# EAGLE design alphanewt_v1.8 (EAGLE 8.4.1)
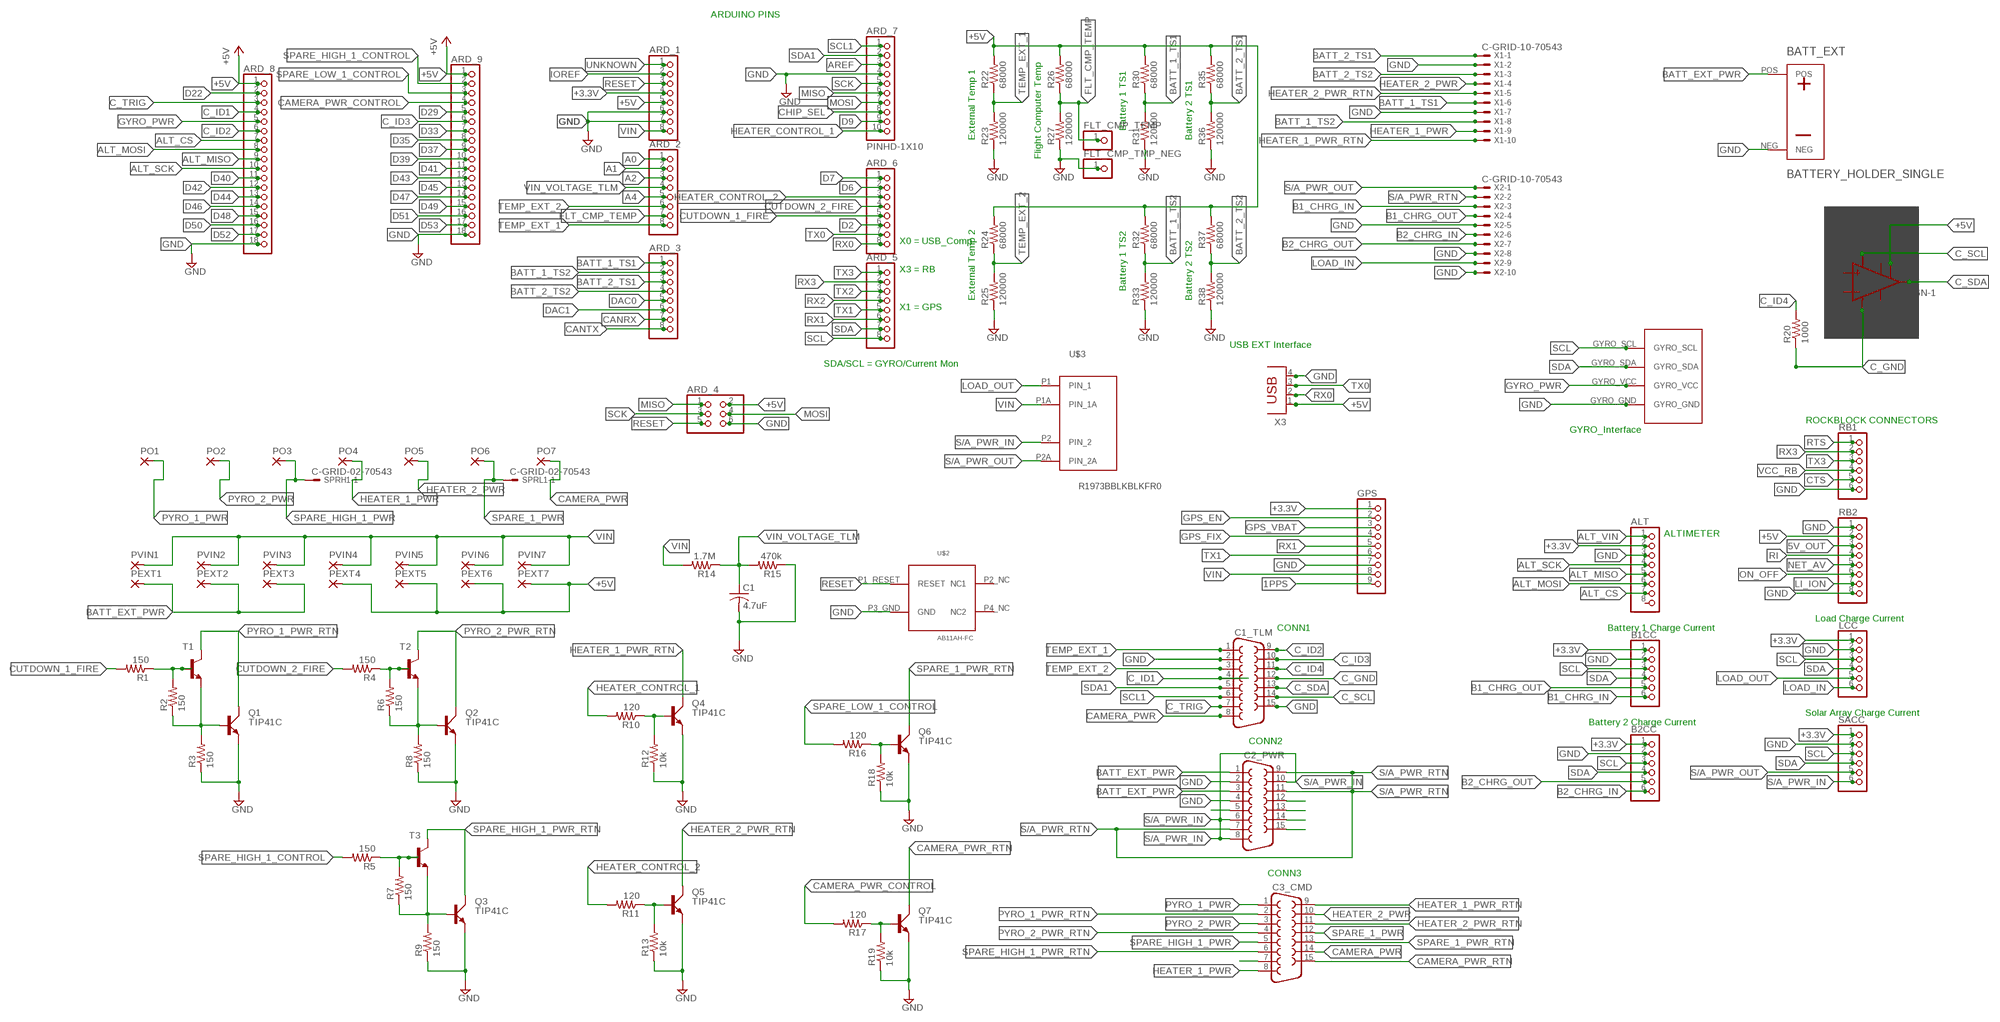
[diagram p0: schematic, sheet 1]

## Parts
ALT  PINHD-1X8BIG  [1X08-BIG]
ARD_1  PINHD-1X8BIG  [1X08-BIG]
ARD_2  PINHD-1X8BIG  [1X08-BIG]
ARD_3  PINHD-1X8BIG  [1X08-BIG]
ARD_4  PINHD-2X3  [2X03]
ARD_5  PINHD-1X8BIG  [1X08-BIG]
ARD_6  PINHD-1X8BIG  [1X08-BIG]
ARD_7  PINHD-1X10  [1X10-BIG]
ARD_8  PINHD-1X18-BIG  [1X18-BIG]
ARD_9  PINHD-1X18-BIG  [1X18-BIG]
B1CC  PINHD-1X6B  [1X06-BIG]
B2CC  PINHD-1X6B  [1X06-BIG]
BATT_EXT  BATTERY_HOLDER_SINGLE  [BATT_HOLDER_SINGLE]
C1  4.7uF  C-USC0805K  [C0805K]
C1_TLM  F15HP  [F15HP]
C2_PWR  F15HP  [F15HP]
C3_CMD  F15HP  [F15HP]
FLT_CMP_TEMP  PINHD-1X1  [1X01]
FLT_CMP_TMP_NEG  PINHD-1X1  [1X01]
GPS  PINHD-1X9  [1X09-BIG]
IC1  LM386N-1  [DIL08]
LCC  PINHD-1X6B  [1X06-BIG]
PEXT1  SMD2  [SMD1,27-2,54]
PEXT2  SMD2  [SMD1,27-2,54]
PEXT3  SMD2  [SMD1,27-2,54]
PEXT4  SMD2  [SMD1,27-2,54]
PEXT5  SMD2  [SMD1,27-2,54]
PEXT6  SMD2  [SMD1,27-2,54]
PEXT7  SMD2  [SMD1,27-2,54]
PO1  SMD2  [SMD1,27-2,54]
PO2  SMD2  [SMD1,27-2,54]
PO3  SMD2  [SMD1,27-2,54]
PO4  SMD2  [SMD1,27-2,54]
PO5  SMD2  [SMD1,27-2,54]
PO6  SMD2  [SMD1,27-2,54]
PO7  SMD2  [SMD1,27-2,54]
PVIN1  SMD2  [SMD1,27-2,54]
PVIN2  SMD2  [SMD1,27-2,54]
PVIN3  SMD2  [SMD1,27-2,54]
PVIN4  SMD2  [SMD1,27-2,54]
PVIN5  SMD2  [SMD1,27-2,54]
PVIN6  SMD2  [SMD1,27-2,54]
PVIN7  SMD2  [SMD1,27-2,54]
Q1  TIP41C  [TO220AV]
Q2  TIP41C  [TO220AV]
Q3  TIP41C  [TO220AV]
Q4  TIP41C  [TO220AV]
Q5  TIP41C  [TO220AV]
Q6  TIP41C  [TO220AV]
Q7  TIP41C  [TO220AV]
R1  150  R-US_R0805  [R0805]
R2  150  R-US_R0805  [R0805]
R3  150  R-US_R0805  [R0805]
R4  150  R-US_R0805  [R0805]
R5  150  R-US_R0805  [R0805]
R6  150  R-US_R0805  [R0805]
R7  150  R-US_R0805  [R0805]
R8  150  R-US_R0805  [R0805]
R9  150  R-US_R0805  [R0805]
R10  120  R-US_R0805  [R0805]
R11  120  R-US_R0805  [R0805]
R12  10k  R-US_R0805  [R0805]
R13  10k  R-US_R0805  [R0805]
R14  1.7M  R-US_R0805  [R0805]
R15  470k  R-US_R0805  [R0805]
R16  120  R-US_R0805  [R0805]
R17  120  R-US_R0805  [R0805]
R18  10k  R-US_R0805  [R0805]
R19  10k  R-US_R0805  [R0805]
R20  1000  R-US_R0805  [R0805]
R22  68000  R-US_R0805  [R0805]
R23  120000  R-US_R0805  [R0805]
R24  68000  R-US_R0805  [R0805]
R25  120000  R-US_R0805  [R0805]
R26  68000  R-US_R0805  [R0805]
R27  120000  R-US_R0805  [R0805]
R30  68000  R-US_R0805  [R0805]
R31  120000  R-US_R0805  [R0805]
R32  68000  R-US_R0805  [R0805]
R33  120000  R-US_R0805  [R0805]
R35  68000  R-US_R0805  [R0805]
R36  120000  R-US_R0805  [R0805]
R37  68000  R-US_R0805  [R0805]
R38  120000  R-US_R0805  [R0805]
RB1  PINHD-1X6CB  [1X06-CLEANBIG]
RB2  PINHD-1X8BIG  [1X08-BIG]
SACC  PINHD-1X6B  [1X06-BIG]
SPRH1  C-GRID-02-70543  [70543-02]
SPRL1  C-GRID-02-70543  [70543-02]
T1  2N3904  [TO92]
T2  2N3904  [TO92]
T3  2N3904  [TO92]
U$2  AB11AH-FC  [AB11AH-FC]
U$3  R1973BBLKBLKFR0  [R1973BBLKBLKFR0]
U$4  GYRO_MPU9250_FOOTPRINT  [MPU9250_FOOTPRINT]
X1  C-GRID-10-70543  [70543-10]
X2  C-GRID-10-70543  [70543-10]
X3  PN87520  [PN87520]

## Nets
1PPS: GPS.9
5V_OUT: RB2.3
+3.3V [PWR]: ALT.2 ARD_1.4 B1CC.1 B2CC.1 GPS.1 LCC.1 SACC.1
+5V [PWR]: ARD_1.5 ARD_4.2 ARD_8.1 ARD_9.1 IC1.8(GAIN) PEXT4.1(P) PEXT5.1(P) PEXT6.1(P) PEXT7.1(P) R22.2 R24.2 R26.2 R30.2 R32.2 R35.2 R37.2 RB2.2 X3.1
A0: ARD_2.1
A1: ARD_2.2
A2: ARD_2.3
A4: ARD_2.5
ALT_CS: ALT.7 ARD_8.7
ALT_MISO: ALT.5 ARD_8.9
ALT_MOSI: ALT.6 ARD_8.8
ALT_SCK: ALT.4 ARD_8.10
ALT_VIN: ALT.1
AREF: ARD_7.3
B1_CHRG_IN [PWR]: B1CC.6 X2.3
B1_CHRG_OUT [PWR]: B1CC.5 X2.4
B2_CHRG_IN [PWR]: B2CC.6 X2.6
B2_CHRG_OUT [PWR]: B2CC.5 X2.7
BATT_1_TS1: ARD_3.1 R30.1 R31.2 X1.6
BATT_1_TS2: ARD_3.2 R32.1 R33.2 X1.8
BATT_2_TS1: ARD_3.3 R35.1 R36.2 X1.1
BATT_2_TS2: ARD_3.4 R37.1 R38.2 X1.3
BATT_EXT_PWR [PWR]: BATT_EXT.POS C2_PWR.1 C2_PWR.3 PEXT1.1(P) PEXT2.1(P) PEXT3.1(P)
C_GND: C1_TLM.12 IC1.4(GND) R20.1
C_ID1: ARD_8.4 C1_TLM.4
C_ID2: ARD_8.6 C1_TLM.9
C_ID3: ARD_9.6 C1_TLM.10
C_ID4: C1_TLM.11 R20.2
C_SCL: C1_TLM.14 IC1.6(VS)
C_SDA: C1_TLM.13 IC1.5(OUT)
C_TRIG: ARD_8.3 C1_TLM.7
CAMERA_PWR [PWR]: C1_TLM.8 C3_CMD.14 PO7.1(P)
CAMERA_PWR_CONTROL: ARD_9.4 R17.2
CAMERA_PWR_RTN [PWR]: C3_CMD.15 Q7.C
CANRX: ARD_3.7
CANTX: ARD_3.8
CHIP_SEL: ARD_7.8
CTS: RB1.5
CUTDOWN_1_FIRE: ARD_6.5 R1.2
CUTDOWN_2_FIRE: ARD_6.4 R4.2
D2: ARD_6.6
D6: ARD_6.2
D7: ARD_6.1
D9: ARD_7.9
D22: ARD_8.2
D29: ARD_9.5
D33: ARD_9.7
D35: ARD_9.8
D37: ARD_9.9
D39: ARD_9.10
D40: ARD_8.11
D41: ARD_9.11
D42: ARD_8.12
D43: ARD_9.12
D44: ARD_8.13
D45: ARD_9.13
D46: ARD_8.14
D47: ARD_9.14
D48: ARD_8.15
D49: ARD_9.15
D50: ARD_8.16
D51: ARD_9.16
D52: ARD_8.17
D53: ARD_9.17
DAC0: ARD_3.5
DAC1: ARD_3.6
FLT_CMP_TEMP: ARD_2.7 FLT_CMP_TEMP.1 R26.1 R27.2
GND [PWR]: ALT.3 ARD_1.6 ARD_1.7 ARD_4.6 ARD_7.4 ARD_8.18 ARD_9.18 B1CC.2 B2CC.2 BATT_EXT.NEG C1.2 C1_TLM.2 C1_TLM.15 C2_PWR.2 C2_PWR.4 FLT_CMP_TMP_NEG.1 GPS.7 LCC.2 Q1.E Q2.E Q3.E Q4.E Q5.E Q6.E Q7.E R3.1 R8.1 R9.1 R12.1 R13.1 R15.1 R18.1 R19.1 R23.1 R25.1 R27.1 R31.1 R33.1 R36.1 R38.1 RB1.6 RB2.1 RB2.8 SACC.2 U$2.P3_GND(GND) U$4.GYRO_GND X1.2 X1.7 X2.5 X2.8 X2.10 X3.4
GPS_EN: GPS.2
GPS_FIX: GPS.4
GPS_VBAT: GPS.3
GYRO_PWR: ARD_8.5 U$4.GYRO_VCC
HEATER_1_PWR [PWR]: C3_CMD.8 PO4.1(P) X1.9
HEATER_1_PWR_RTN [PWR]: C3_CMD.9 Q4.C X1.10
HEATER_2_PWR [PWR]: C3_CMD.10 PO5.1(P) X1.4
HEATER_2_PWR_RTN [PWR]: C3_CMD.11 Q5.C X1.5
HEATER_CONTROL_1: ARD_7.10 R10.2
HEATER_CONTROL_2: ARD_6.3 R11.2
IOREF: ARD_1.2
LI_ION: RB2.7
LOAD_IN [PWR]: LCC.6 X2.9
LOAD_OUT [PWR]: LCC.5 U$3.P1(PIN_1)
MISO: ARD_4.1 ARD_7.6
MOSI: ARD_4.4 ARD_7.7
N$15: R4.1 R6.2 T2.2(B)
N$16: R1.1 R2.2 T1.2(B)
N$18: Q4.B R10.1 R12.2
N$19: Q2.B R6.1 R8.2 T2.3(E)
N$22: Q5.B R11.1 R13.2
N$23: Q1.B R2.1 R3.2 T1.3(E)
N$24: Q6.B R16.1 R18.2
N$26: R5.1 R7.2 T3.2(B)
N$27: Q3.B R7.1 R9.2 T3.3(E)
N$31: Q7.B R17.1 R19.2
N$47: C2_PWR.12
N$48: C2_PWR.13
N$49: C2_PWR.14
N$50: C2_PWR.15
N$55: C2_PWR.5
N$72 [PWR]: C3_CMD.7
NET_AV: RB2.5
ON_OFF: RB2.6
PYRO_1_PWR [PWR]: C3_CMD.1 PO1.1(P)
PYRO_1_PWR_RTN [PWR]: C3_CMD.2 Q1.C T1.1(C)
PYRO_2_PWR [PWR]: C3_CMD.3 PO2.1(P)
PYRO_2_PWR_RTN [PWR]: C3_CMD.4 Q2.C T2.1(C)
RESET: ARD_1.3 ARD_4.5 U$2.P1_RESET(RESET)
RI: RB2.4
RTS: RB1.1
RX0: ARD_6.8 X3.2
RX1: ARD_5.6 GPS.5
RX2: ARD_5.4
RX3: ARD_5.2 RB1.2
S/A_PWR_IN [PWR]: C2_PWR.6 C2_PWR.8 C2_PWR.10 SACC.6 U$3.P2(PIN_2)
S/A_PWR_OUT [PWR]: SACC.5 U$3.P2A(PIN_2A) X2.1
S/A_PWR_RTN [PWR]: C2_PWR.7 C2_PWR.9 C2_PWR.11 X2.2
SCK: ARD_4.3 ARD_7.5
SCL: ARD_5.8 B1CC.3 B2CC.3 LCC.3 SACC.3 U$4.GYRO_SCL
SCL1: ARD_7.1 C1_TLM.6
SDA: ARD_5.7 B1CC.4 B2CC.4 LCC.4 SACC.4 U$4.GYRO_SDA
SDA1: ARD_7.2 C1_TLM.5
SPARE_1_PWR [PWR]: C3_CMD.12 PO6.1(P) SPRL1.1
SPARE_1_PWR_RTN [PWR]: C3_CMD.13 Q6.C
SPARE_HIGH_1_CONTROL: ARD_9.2 R5.2
SPARE_HIGH_1_PWR [PWR]: C3_CMD.5 PO3.1(P) SPRH1.1
SPARE_HIGH_1_PWR_RTN [PWR]: C3_CMD.6 Q3.C T3.1(C)
SPARE_LOW_1_CONTROL: ARD_9.3 R16.2
TEMP_EXT_1: ARD_2.8 C1_TLM.1 R22.1 R23.2
TEMP_EXT_2: ARD_2.6 C1_TLM.3 R24.1 R25.2
TX0: ARD_6.7 X3.3
TX1: ARD_5.5 GPS.6
TX2: ARD_5.3
TX3: ARD_5.1 RB1.3
UNKNOWN: ARD_1.1
VCC_RB: RB1.4
VIN [PWR]: ARD_1.8 GPS.8 PVIN1.1(P) PVIN2.1(P) PVIN3.1(P) PVIN4.1(P) PVIN5.1(P) PVIN6.1(P) PVIN7.1(P) R14.2 U$3.P1A(PIN_1A)
VIN_VOLTAGE_TLM: ARD_2.4 C1.1 R14.1 R15.2
Unconnected: ALT.8 IC1.1(GAIN) IC1.2(-IN) IC1.3(+IN) IC1.7(BYPASS) SPRH1.2 SPRL1.2 U$2.P2_NC(NC1) U$2.P4_NC(NC2)

## Notes on the sheet
- ARDUINO PINS
- Battery 1 TS1
- External Temp 1 | Battery 2 TS1
- Flight Computer Temp
- X0 = USB_Comp
- X3 = RB
- Battery 1 TS2
- External Temp 2 | Battery 2 TS2
- X1 = GPS
- USB EXT Interface
- SDA/SCL = GYRO/Current Mon
- ROCKBLOCK CONNECTORS
- GYRO_Interface
- ALTIMETER
- Load Charge Current
- CONN1 | Battery 1 Charge Current
- Solar Array Charge Current
- Battery 2 Charge Current
- CONN2
- CONN3

## Library data of the parts
ALT ARD_1-ARD_3 ARD_5 ARD_6 RB2 = adafruit:PINHD-1X8: PIN HEADER; OC_NEWARK: unknown
ARD_4 = pinhead:PINHD-2X3: PIN HEADER; OC_NEWARK: unknown
ARD_7 = adafruit:PINHD-1X10: Pin header 1x10 0.1" spacing With round pins; OC_NEWARK: unknown
ARD_8 ARD_9 = adafruit:PINHD-1X18: PIN HEADER; OC_NEWARK: unknown
B1CC B2CC LCC RB1 SACC = adafruit:PINHD-1X6: PIN HEADER; OC_NEWARK: unknown
BATT_EXT = Battery_Holder_Single:BATTERY_HOLDER_SINGLE
C1 = adafruit:C-US: CAPACITOR, American symbol; MPN: C2012X6S1H475K125AC; OC_NEWARK: 95Y0059
C1_TLM C2_PWR C3_CMD = adafruit:F15: SUB-D HDH is also known as a 'right angle VGA' connector; MPN: 5504F1-15S-02A-03; OC_NEWARK: 18T0705
FLT_CMP_TEMP FLT_CMP_TMP_NEG = adafruit:PINHD-1X1: Pin header 1x1 for 0.1" spacing With round pins; OC_NEWARK: unknown
GPS = adafruit:PINHD-1X9: Pin header 1x10 0.1" spacing With round pins
IC1 = linear:LM386?-*: Low Voltage Audio Power Amplifier Source: http://cache.national.com/ds/LM/LM386.pdf
PEXT1-PEXT7 PO1-PO7 PVIN1-PVIN7 = wirepad:SMD2: SMD PAD; OC_NEWARK: unknown
Q1-Q7 = transistor-power:TIP41C: NPN TRANSISTOR; MF: FAIRCHILD SEMICONDUCTOR; MPN: TIP41C; OC_NEWARK: 58K2429
R1-R20 R22-R27 R30-R33 R35-R38 = adafruit:R-US_: RESISTOR, American symbol; MF: VISHAY/DALE; MPN: CRCW120633R2FKEA; OC_NEWARK: 42K4999
SPRH1 SPRL1 = con-molex:C-GRID-02: CONNECTOR wire to board 2.54 mm (0.100") pitch header; MF: MOLEX; MPN: 70543-0001; OC_FARNELL: unknown; OC_NEWARK: 59H2645
T1-T3 = transistor:2N3904: NPN TRANSISTOR; MF: NTE ELECTRONICS; MPN: 2N3904; OC_NEWARK: 33C8259
U$2 = AB11AH-FC:AB11AH-FC
U$3 = R1973BBLKBLKFR0:R1973BBLKBLKFR0
U$4 = GYRO_MPU9250_FOOTPRINT:GYRO_MPU9250_FOOTPRINT
X1 X2 = con-molex:C-GRID-10: CONNECTOR wire to board 2.54 mm (0.100") pitch header; OC_FARNELL: unknown; OC_NEWARK: unknown
X3 = con-berg:PN87520: BERG USB connector; OC_FARNELL: unknown; OC_NEWARK: unknown

## Net classes
0 default: width 0.305 mm, drill 0.508 mm, clearance 0.254 mm
1 PWR: width 0.406 mm, drill 0.508 mm, clearance 0.305 mm

## Board
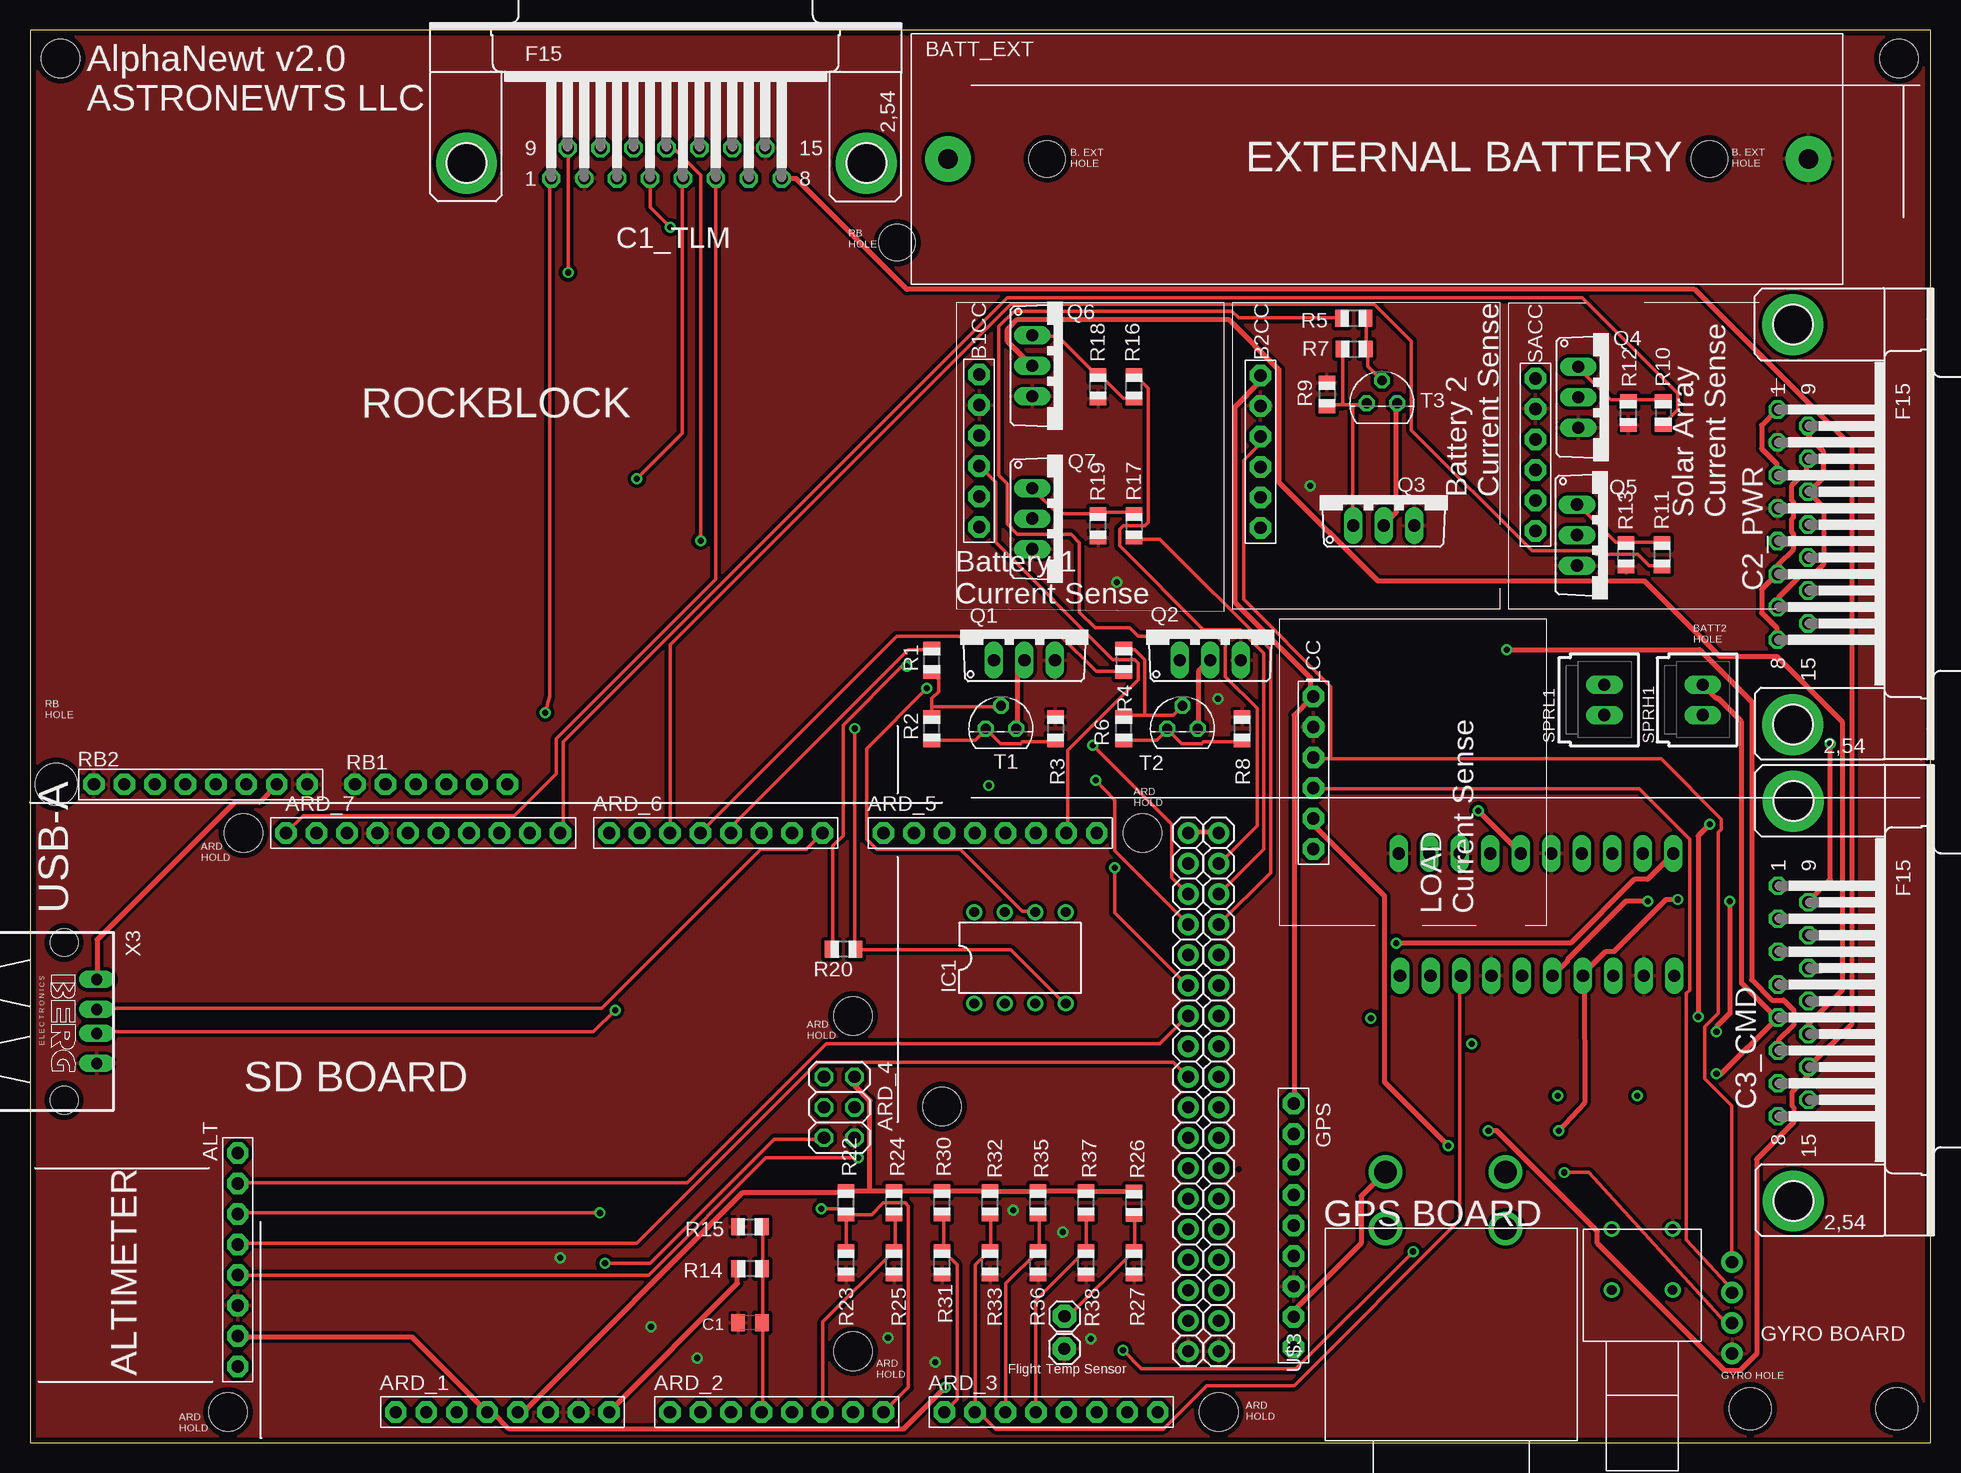
[diagram p1: board, top side]
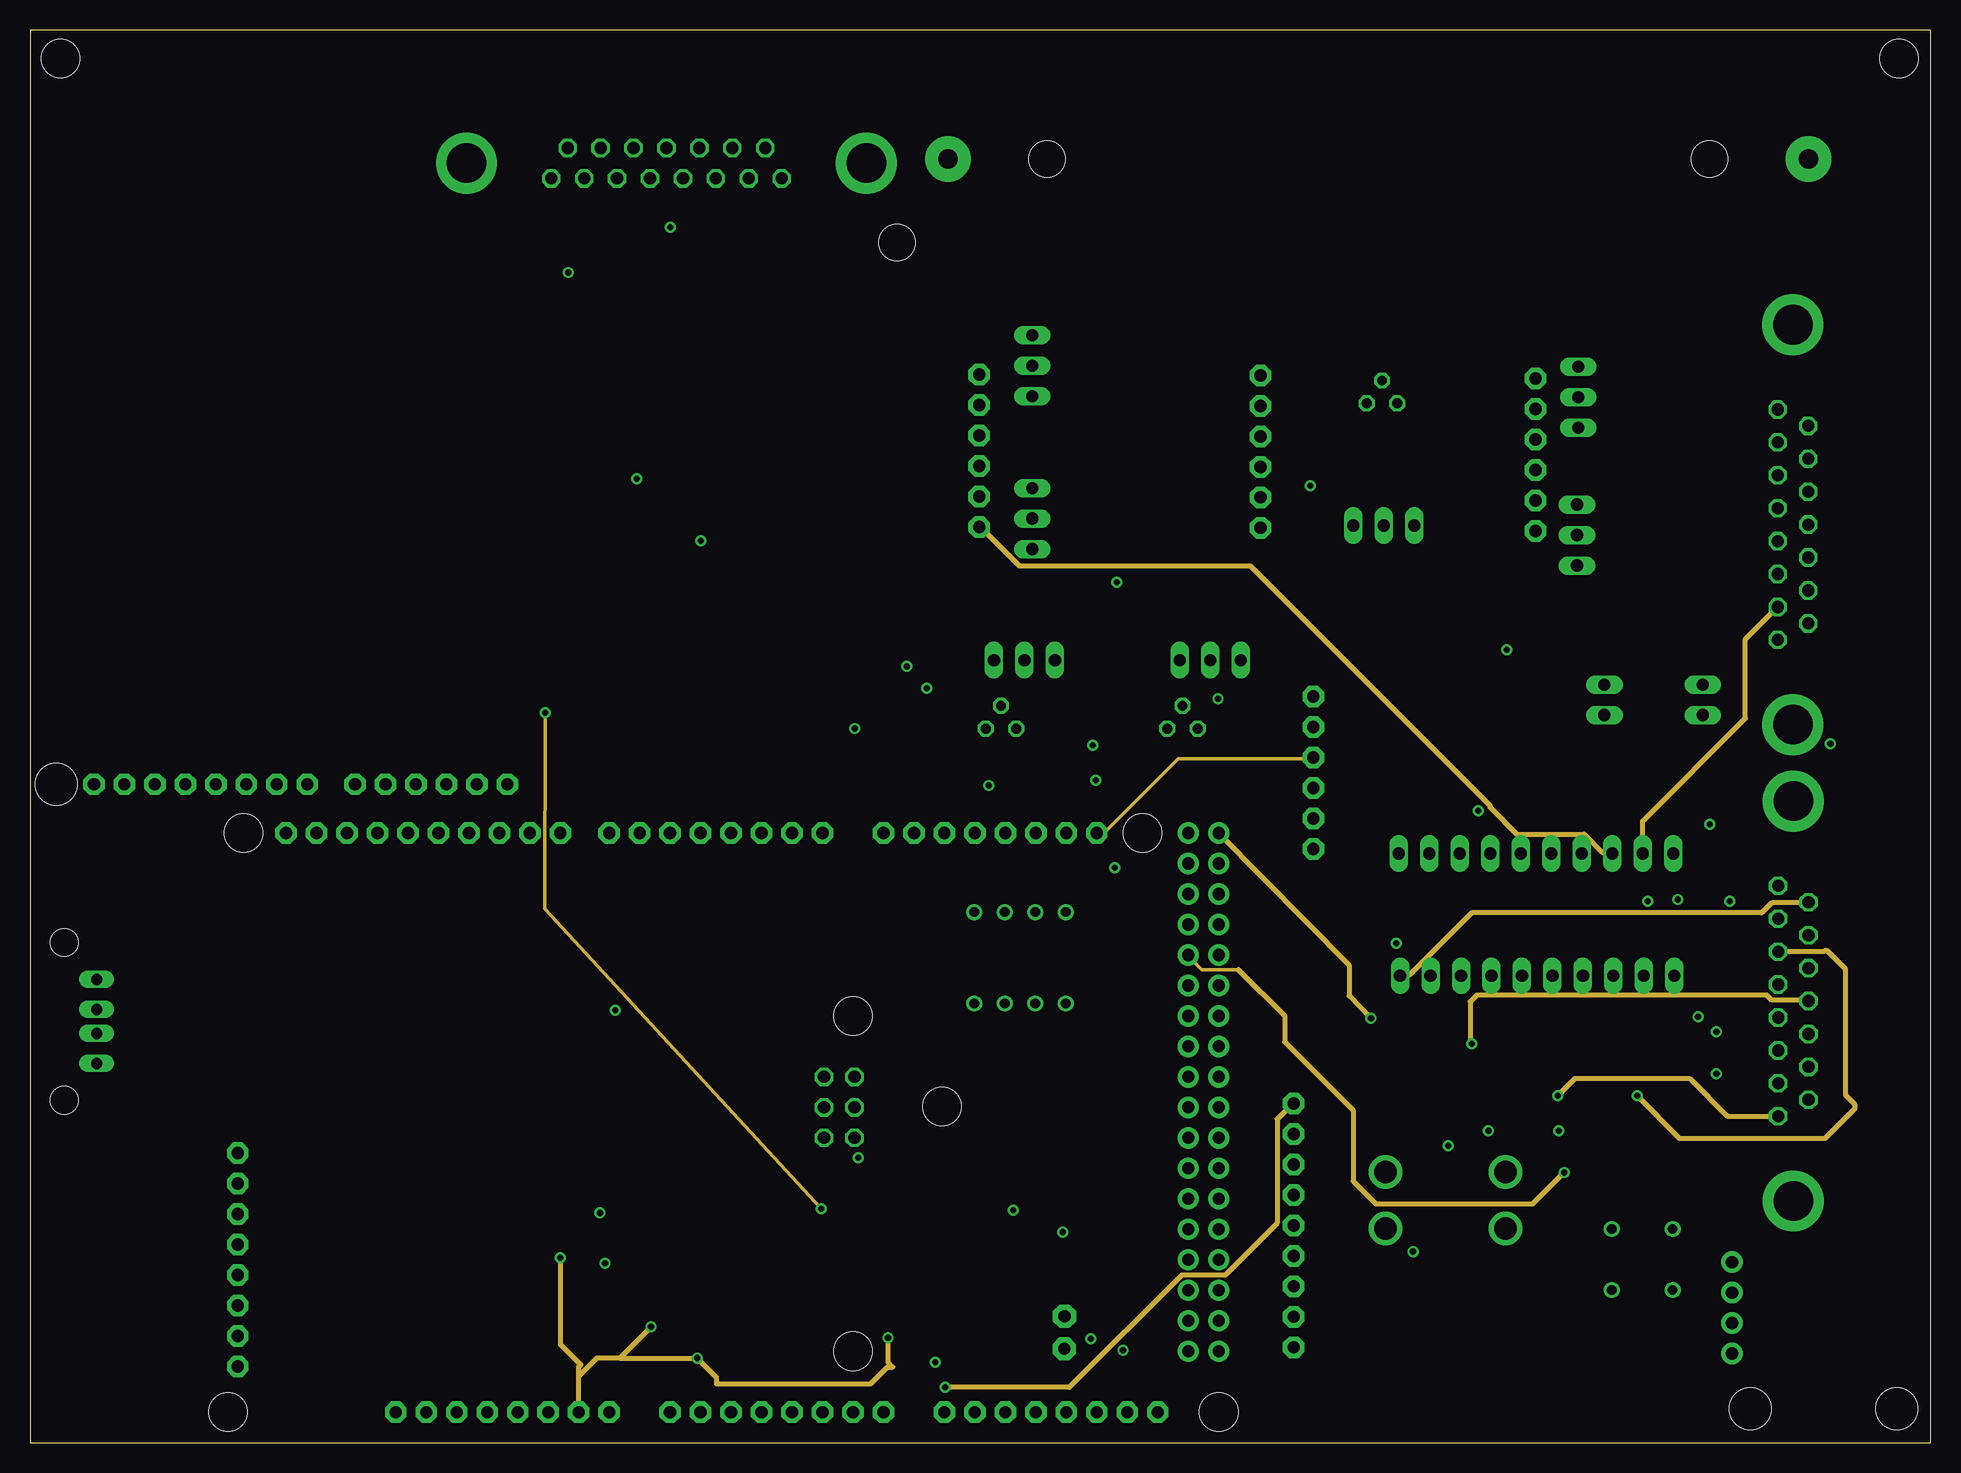
[diagram p2: board, inner layer Route2]
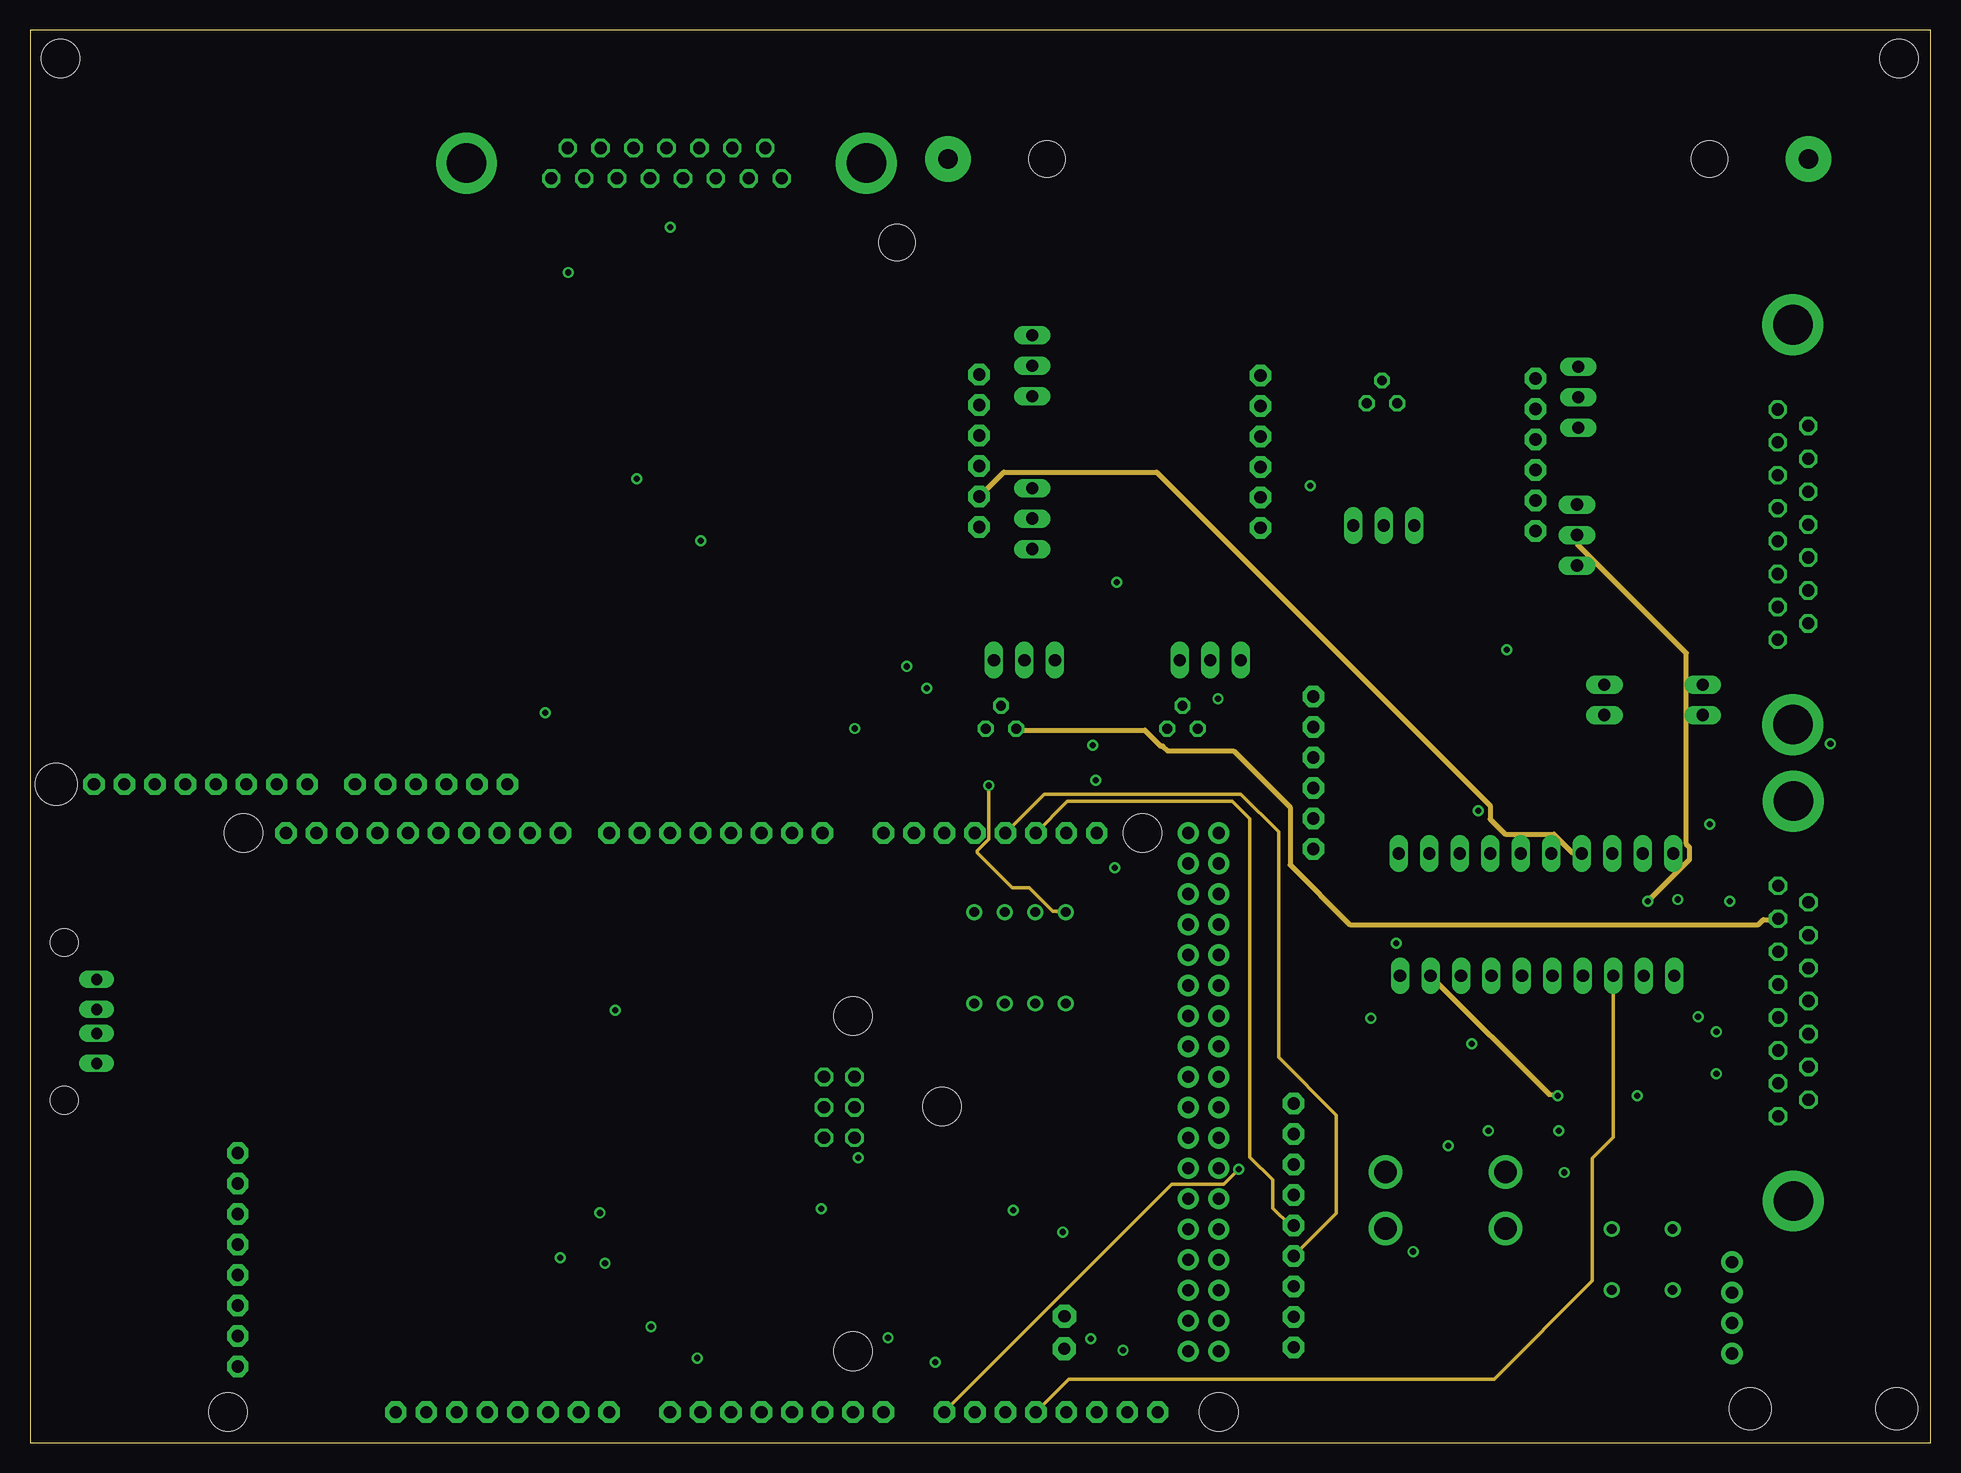
[diagram p3: board, inner layer Route15]
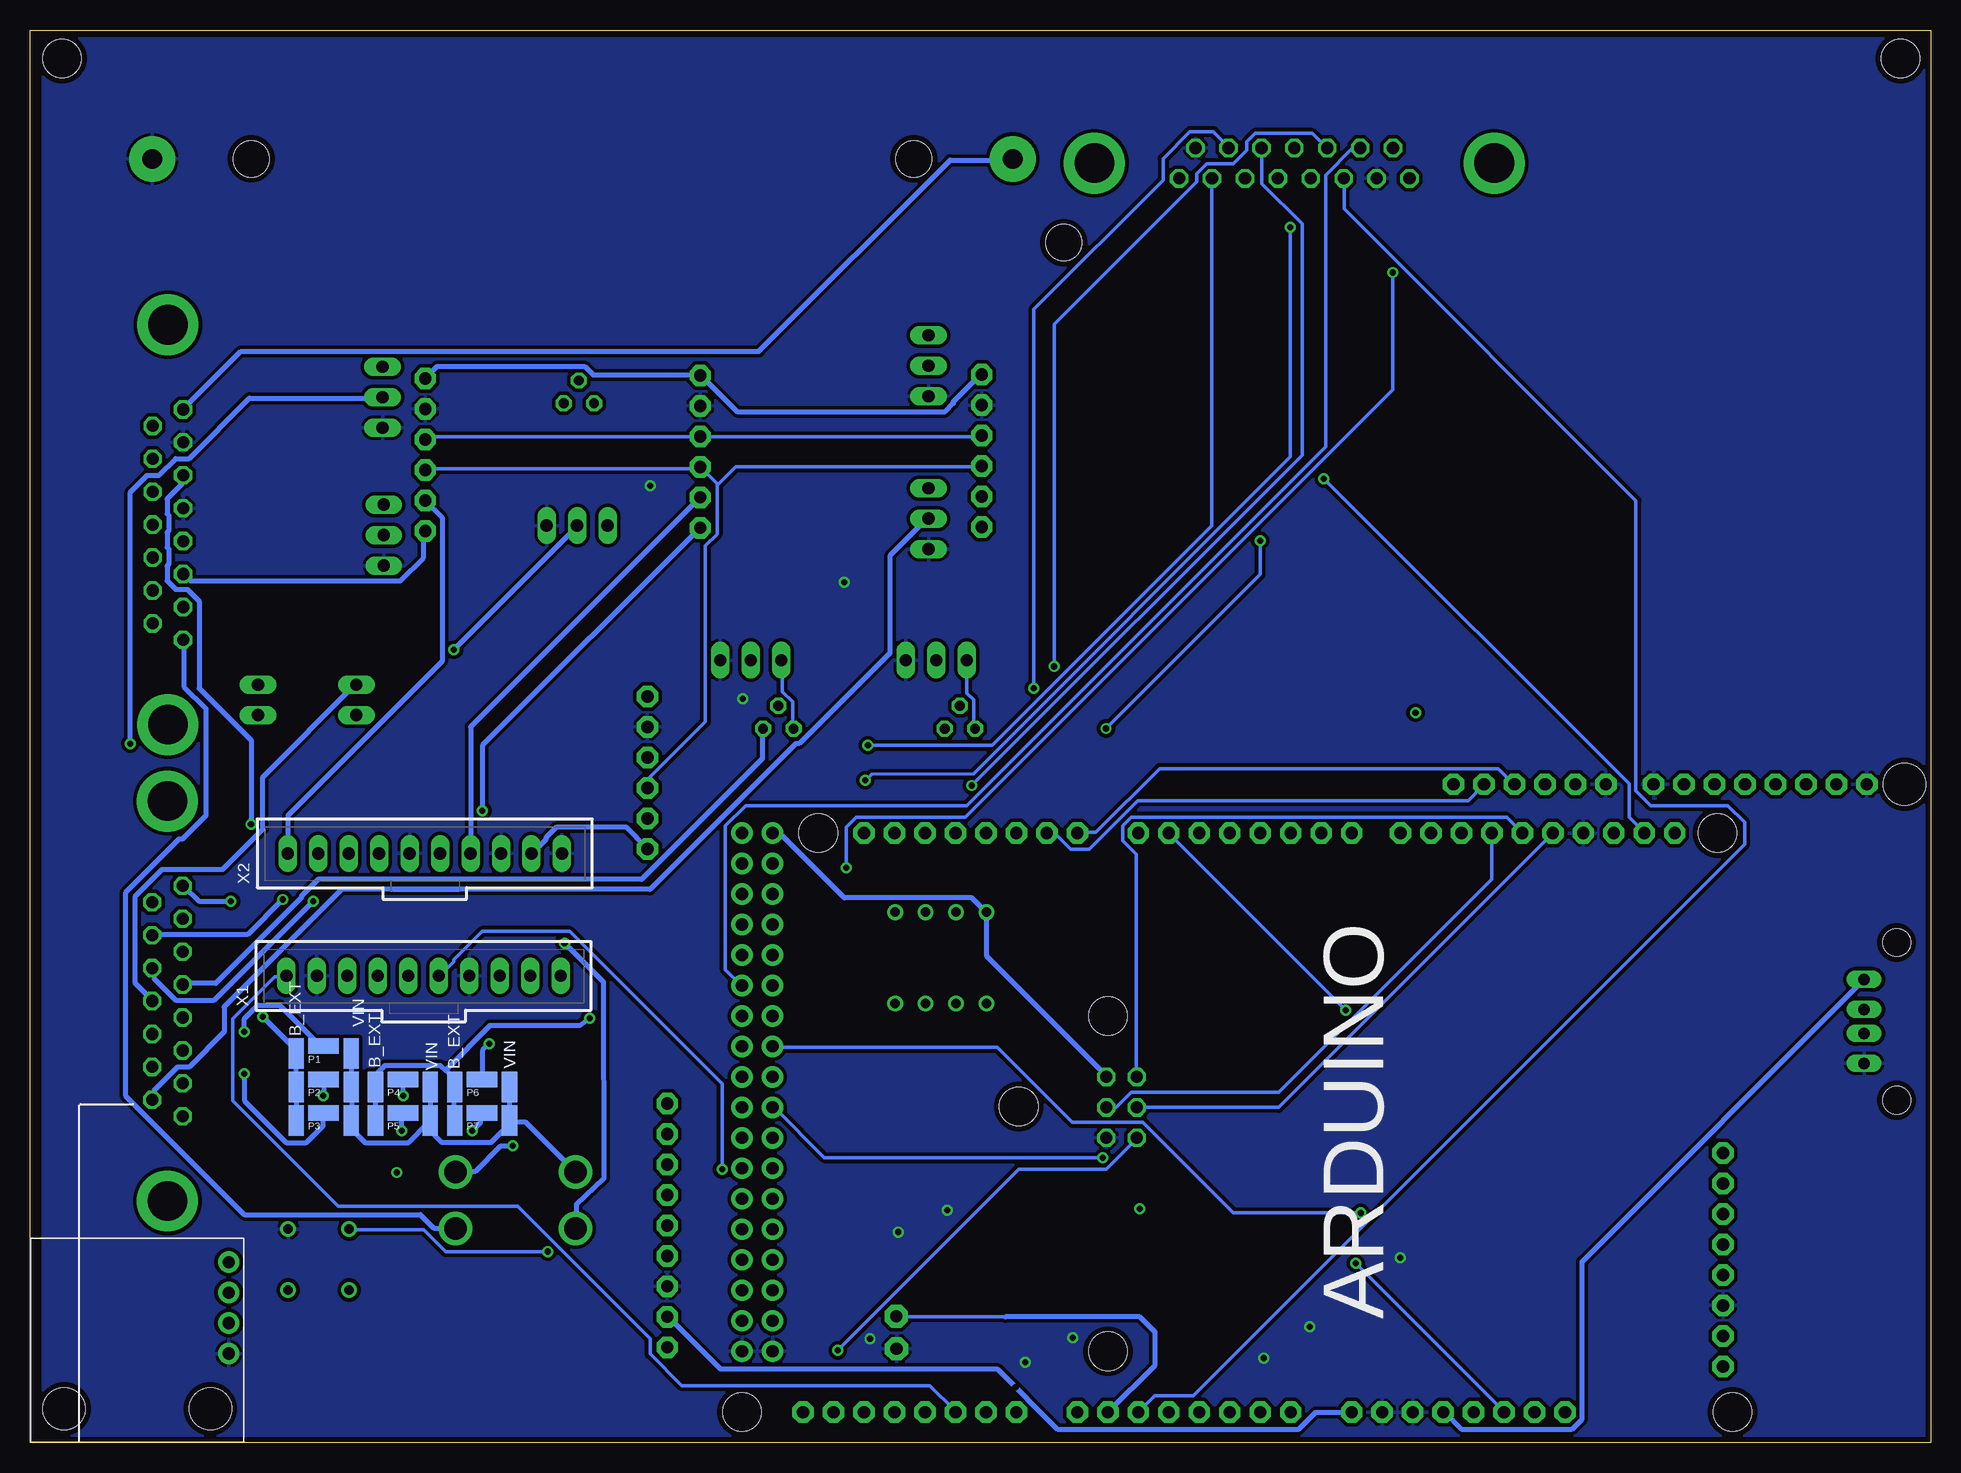
[diagram p4: board, bottom side, seen from below]

Size 158.4 x 117.72 mm. Coordinates in mm from the lower left corner, seen from the top.
Outline: 0,0 158.4,0 158.4,117.72 0,117.72 0,0
Copper layers ((1*2)+(15*16)): Top 0.035mm / dielectric 0.2mm / Route2 0.035mm / dielectric 0.2mm / Route15 0.035mm / dielectric 0.2mm / Bottom 0.035mm
Design rules "default *": minimum track width 6mil, minimum drill 0.35mm, track to track 6mil, track to pad 6mil, pad to pad 6mil, via to via 6mil, smd to smd 6mil, copper to edge 18mil, drill to drill 6mil, minimum pad ring 10mil, minimum via ring 8mil, stop-mask expansion 4mil, vias tented up to drill 0mil, thermal gap 10mil
Holes 3.2 mm at 16.51,2.54 99.06,2.54 68.58,7.62 68.58,35.56 92.71,50.8 17.78,50.8 2.54,115.33 155.74,115.33 76,28
Holes 3.5 mm at 2.18,54.86
Holes 3 mm at 72.25,100

### Footprints (pad centres in the part's own frame; a part is rotated, then mirrored left to right if it is on the bottom)
1X08-BIG = drill 1.016 pad 1.778 octagon: 1 -8.89,0; 2 -6.35,0; 3 -3.81,0; 4 -1.27,0; 5 1.27,0; 6 3.81,0; 7 6.35,0; 8 8.89,0
2X03 = drill 1.016 octagon: 1 -2.54,-1.27; 2 -2.54,1.27; 3 0,-1.27; 4 0,1.27; 5 2.54,-1.27; 6 2.54,1.27
1X10-BIG = drill 1.016 pad 1.778 octagon: 1 -11.43,0; 2 -8.89,0; 3 -6.35,0; 4 -3.81,0; 5 -1.27,0; 6 1.27,0; 7 3.81,0; 8 6.35,0; 9 8.89,0; 10 11.43,0
1X18-BIG = drill 1.016 pad 1.778: 1 -21.59,0; 2 -19.05,0; 3 -16.51,0; 4 -13.97,0; 5 -11.43,0; 6 -8.89,0; 7 -6.35,0; 8 -3.81,0; 9 -1.27,0; 10 1.27,0; 11 3.81,0; 12 6.35,0; 13 8.89,0; 14 11.43,0; 15 13.97,0; 16 16.51,0; 17 19.05,0; 18 21.59,0
1X06-BIG = drill 1.016 pad 1.778 octagon: 1 -6.35,0; 2 -3.81,0; 3 -1.27,0; 4 1.27,0; 5 3.81,0; 6 6.35,0
BATT_HOLDER_SINGLE = drill 1.65 pad 3.81: NEG 74.75,10.45; POS 3.05,10.45 | hole 3: 11.3,10.45; 66.5,10.45
C0805K = smd 1.1 x 1.4: 1 -1,0; 2 1,0
F15HP = drill 1.016 octagon: 1 -9.601,-1.27; 2 -6.858,-1.27; 3 -4.115,-1.27; 4 -1.372,-1.27; 5 1.372,-1.27; 6 4.115,-1.27; 7 6.858,-1.27; 8 9.601,-1.27; 9 -8.23,1.27; 10 -5.486,1.27; 11 -2.743,1.27; 12 0,1.27; 13 2.743,1.27; 14 5.486,1.27; 15 8.23,1.27 | drill 3.302 pad 5.08: G1 -16.662,0; G2 16.662,0
1X01 = drill 1.016 pad 1.93 octagon: 1 0,0
1X09-BIG = drill 1.016 pad 1.778 octagon: 1 -10.16,0; 2 -7.62,0; 3 -5.08,0; 4 -2.54,0; 5 0,0; 6 2.54,0; 7 5.08,0; 8 7.62,0; 9 10.16,0
DIL08 = drill 0.813 pad 1.27: 1 -3.81,-3.81; 2 -1.27,-3.81; 3 1.27,-3.81; 4 3.81,-3.81; 5 3.81,3.81; 6 1.27,3.81; 7 -1.27,3.81; 8 -3.81,3.81
SMD1,27-2,54 = smd 1.27 x 2.54: 1 0,0
TO220AV = drill 1.016 long: B -2.54,-2.54; C 0,-2.54; E 2.54,-2.54
R0805 = smd 1.1 x 1.4: 1 -1,0; 2 1,0
1X06-CLEANBIG = drill 1.016 pad 1.778 octagon: 1 -6.35,0; 2 -3.81,0; 3 -1.27,0; 4 1.27,0; 5 3.81,0; 6 6.35,0
70543-02 = drill 1.016 long: 1 -1.27,0; 2 1.27,0
TO92 = drill 0.813 octagon: 1 1.27,0; 2 0,1.905; 3 -1.27,0
AB11AH-FC = drill 0.8: P1_RESET 2.54,0; P2_NC 2.54,5.08; P3_GND -2.54,0; P4_NC -2.54,5.08
R1973BBLKBLKFR0 = drill 1.85: P1 4.7,0; P1A 4.7,10; P2 0,0; P2A 0,10
MPU9250_FOOTPRINT = drill 1.016 pad 1.778: GYRO_GND 9.627,16.51; GYRO_SCL 2.007,16.51; GYRO_SDA 4.547,16.51; GYRO_VCC 7.087,16.51 | hole 3.505: 14.224,2.794; 14.224,14.986
70543-10 = drill 1.016 long: 1 -11.43,0; 2 -8.89,0; 3 -6.35,0; 4 -3.81,0; 5 -1.27,0; 6 1.27,0; 7 3.81,0; 8 6.35,0; 9 8.89,0; 10 11.43,0
PN87520 = drill 0.95 long: 1 -3.5,2.71; 2 -1,2.71; 3 1,2.71; 4 3.5,2.71 | hole 2.3: -6.57,0; 6.57,0

### Placement (x,y rotation side)
ALT  17.31,15.24 90 top
ARD_1  39.37,2.54 0 top
ARD_2  62.23,2.54 0 top
ARD_3  85.09,2.54 0 top
ARD_4  67.44,27.94 270 top
ARD_5  80.01,50.8 0 top
ARD_6  57.15,50.8 0 top
ARD_7  32.77,50.8 0 top
ARD_8  96.52,29.21 270 top
ARD_9  99.06,29.21 270 top
B1CC  79.09,82.65 270 top
B2CC  102.54,82.58 270 top
BATT_EXT  73.46,96.52 0 top
C1  60,10 180 top
C1_TLM  53.04,106.62 0 top
C2_PWR  146.91,76.5 270 top
C3_CMD  146.95,36.8 270 top
FLT_CMP_TEMP  86.21,10.53 0 top
FLT_CMP_TMP_NEG  86.19,7.82 0 top
GPS  105.3,18.1 270 top
IC1  82.5,40.4 0 top
LCC  106.95,55.83 270 top
PEXT1  136.21,32.42 0 bottom
PEXT2  136.21,29.62 0 bottom
PEXT3  136.21,26.83 0 bottom
PEXT4  129.61,29.62 0 bottom
PEXT5  129.61,26.83 180 bottom
PEXT6  123,29.62 0 bottom
PEXT7  123,26.83 0 bottom
PO1  133.93,33.05 90 bottom
PO2  133.93,30.26 270 bottom
PO3  133.93,27.46 270 bottom
PO4  127.32,30.26 270 bottom
PO5  127.32,27.46 270 bottom
PO6  120.72,30.26 270 bottom
PO7  120.72,27.46 270 bottom
PVIN1  131.64,32.42 180 bottom
PVIN2  131.64,29.62 0 bottom
PVIN3  131.64,26.83 0 bottom
PVIN4  125.04,29.62 0 bottom
PVIN5  125.04,26.83 180 bottom
PVIN6  118.43,29.62 0 bottom
PVIN7  118.43,26.83 0 bottom
Q1  82.87,67.75 0 top
Q2  98.35,67.75 0 top
Q3  112.81,78.96 0 top
Q4  131.56,87.11 270 top
Q5  131.46,75.63 270 top
Q6  86.06,89.73 270 top
Q7  86.06,77 270 top
R1  75.15,65.2 90 top
R2  75.15,59.5 90 top
R3  85.45,59.5 270 top
R4  91.15,65.2 270 top
R5  110.3,93.69 180 top
R6  91.15,59.5 90 top
R7  110.34,91.14 0 top
R8  101,59.5 270 top
R9  108.08,87.34 270 top
R10  136.1,85.8 270 top
R11  136,74 270 top
R12  133.2,85.8 90 top
R13  133,74 90 top
R14  60,14.5 180 top
R15  60,18 0 top
R16  92,88 90 top
R17  92,76.4 270 top
R18  89,88 90 top
R19  89,76.4 90 top
R20  67.79,41.12 180 top
R22  68,20 90 top
R23  68,15 90 top
R24  72,20 90 top
R25  72,15 90 top
R26  92,19.96 90 top
R27  92,15 90 top
R30  76,20 90 top
R31  76,15 90 top
R32  80,20 90 top
R33  80,15 90 top
R35  84,20 90 top
R36  84,15 90 top
R37  88,20 90 top
R38  88,15 90 top
RB1  33.43,54.86 180 top
RB2  14.22,54.86 180 top
SACC  125.46,82.33 270 top
SPRH1  139.4,61.9 270 top
SPRL1  131.2,61.9 270 top
T1  80.91,59.5 0 top
T2  96.04,59.5 0 top
T3  112.66,86.61 0 top
U$2  134.35,17.8 180 top
U$3  122.95,17.85 90 top
U$4  158.35,17.05 270 bottom
X1  125.6,38.9 0 bottom
X2  125.5,49.1 0 bottom
X3  2.85,35.1 270 top

### Tracks (layer width: path | path; a pad name or v marks a point on that pad's centre or on a via)
+3.3V  (via drill 0.51 layers 1-2)
  Top 0.406: ALT.2 17.32,8.8 31.85,8.8 38,2.65 ARD_1.4 38.28,2.52 38.56,2.52 39.95,1.12 72.78,1.12 v76.28,4.61 | GPS.1 105.33,28.36 105.33,60.63 106.87,62.17 LCC.1 106.73,62.31 106.73,63.7 100.44,69.99 100.44,86.33 102.54,88.43 102.54,88.85 B2CC.1
  Route2 0.406: v76.28,4.61 86.61,4.61 95.97,13.97 99.61,13.97 103.94,18.3 103.94,26.96 105.19,28.22 GPS.1
  Bottom 0.406: SACC.1 125.45,88.71 124.47,89.69 112.18,89.69 111.48,88.99 102.68,88.99 B2CC.1 102.4,88.85 99.47,85.92 82.14,85.92 81.44,86.61 81.44,86.75 79.21,88.99 B1CC.1
+5V  (via drill 0.51)
  Top 0.406: ARD_8.1 96.53,50.85 99.05,50.85 ARD_9.1 | X3.1 5.59,38.7 5.59,41.91 17.04,53.37 19.14,53.37 20.54,54.76 RB2.2 | R26.2 91.92,20.95 88.15,20.95 R37.2 87.87,20.95 84.1,20.95 R35.2 83.82,20.95 80.19,20.95 R32.2 79.91,20.95 76.14,20.95 R30.2 75.86,20.95 72.08,20.95 R24.2 71.94,20.95 69.99,20.95 | 69.99,20.95 68.03,20.95 R22.2 67.89,20.82 59.37,20.82 41.21,2.65 40.65,2.65 ARD_1.5 | 69.99,20.95 69.99,28.5 68.73,29.76 68.73,30.45 ARD_4.2
  Route2 0.406: ARD_9.1 109.93,39.78 109.93,37.24 v111.75,35.38
  Route15 0.406: 99.19,50.71 ARD_9.1
  Bottom 0.406: PEXT7.1 123.08,26.96 123.08,29.62 PEXT6.1 123.22,29.76 123.22,30.45 123.77,31.01 | PEXT5.1 129.64,26.96 129.64,29.62 PEXT4.1 129.5,29.76 129.5,30.73 128.8,31.43 124.19,31.43 123.77,31.01 | ARD_4.2 68.73,30.59 78.65,40.51 78.65,44.15 IC1.8 78.79,44.28 79.91,45.4 90.53,45.4 95.83,50.71 96.39,50.71 ARD_8.1 | 123.77,31.01 120.1,34.74 116.87,34.74 112.6,34.76 v111.75,35.38 | X3.1 5.59,38.56 29.06,15.09 29.06,1.96 29.9,1.12 39.12,1.12 40.51,2.52 ARD_1.5
ALT_CS
  Top 0.305: ALT.7 17.32,21.65 54.76,21.65 66.36,33.25 94.16,33.25 96.39,35.48 ARD_8.7
ALT_MISO
  Top 0.305: ALT.5 17.32,16.62 50.57,16.62 65.66,31.71 95.28,31.71 96.39,30.59 ARD_8.9
ALT_MOSI  (via drill 0.51)
  Top 0.305: v47.5,19.14 17.32,19.14 ALT.6
  Bottom 0.305: v47.5,19.14 58.12,19.14 65.66,26.68 71.53,26.68 77.81,32.97 96.39,32.97 ARD_8.8
ALT_SCK  (via drill 0.51)
  Top 0.305: ALT.4 51.55,13.97 61.33,23.75 v69.01,23.75
  Bottom 0.305: v69.01,23.75 92.2,23.75 96.39,27.94 ARD_8.10
B1_CHRG_IN
  Route2 0.406: X2.3 131.74,49.17 131.04,49.17 129.5,50.71 123.91,50.71 121.68,52.95 121.68,53.09 101.7,73.06 82.42,73.06 79.21,76.28 B1CC.6
B1_CHRG_OUT
  Route15 0.406: X2.4 129.22,49.17 128.52,49.17 126.99,50.71 122.94,50.71 121.68,51.97 121.68,53.09 93.88,80.89 81.17,80.89 79.21,78.93 B1CC.5
B2_CHRG_IN  (via drill 0.51)
  Top 0.406: v120.7,52.67 124.19,49.17 X2.6
  Bottom 0.406: v120.7,52.67 120.7,58.12 102.68,76.14 B2CC.6
B2_CHRG_OUT
  Bottom 0.406: X2.7 121.68,49.17 121.68,59.65 102.68,78.65 B2CC.5
BATT_1_TS1  (via drill 0.51 layers 15-16)
  Top 0.305: R30.1 76.14,19 76.14,16.07 R31.2 76.14,15.93 77.25,14.81 77.25,3.63 76.28,2.65 ARD_3.1
  Route15 0.305: v100.72,22.77 99.47,21.51 95.14,21.51 76.28,2.65 ARD_3.1
  Bottom 0.305: v100.72,22.77 100.72,29.9 113.44,42.61 120.7,42.61 123.08,40.23 123.08,40.09 124.19,38.98 X1.6
BATT_1_TS2
  Top 0.305: R32.1 80.05,19 80.05,16.07 R33.2 79.91,15.93 78.79,14.81 78.79,2.65 ARD_3.2 78.93,2.65 80.47,1.12 94.44,1.12 98.07,4.75 105.33,4.75 119.16,18.58 119.16,38.84 X1.8
BATT_2_TS1
  Top 0.305: R35.1 84.1,19 84.1,16.07 R36.2 83.96,15.93 81.31,13.27 81.31,2.65 ARD_3.3
  Bottom 0.305: X1.1 137.05,38.84 138.02,38.84 141.52,35.34 141.52,28.5 132.72,19.7 117.77,19.7 106.73,8.66 106.73,7.4 104.08,4.75 83.4,4.75 81.31,2.65 ARD_3.3
BATT_2_TS2
  Top 0.305: R37.1 88.01,16.07 R38.2 87.87,15.93 83.82,11.87 ARD_3.4
  Route15 0.305: ARD_3.4 86.58,5.3 122,5.3 130.2,13.5 130.2,23.7 131.95,25.45 X1.3
BATT_EXT_PWR  (via drill 0.51)
  Top 0.406: C2_PWR.3 145.57,80.75 145.57,81.58 144.31,82.84 144.31,84.8 145.57,86.06 C2_PWR.1 | v139,35.48 139,50.57 v139.98,51.55
  Bottom 0.406: PEXT3.1 136.21,26.96 PEXT2.1 136.21,29.76 PEXT1.1 136.35,32.55 136.35,32.83 v139,35.48 | v139.98,51.55 139.98,58.53 144.31,62.87 144.31,70.13 145.29,71.11 146.27,71.11 146.96,71.81 146.96,73.06 146.82,73.2 146.82,74.46 146.96,74.6 146.96,75.86 146.82,76 146.82,77.25 146.96,77.39 146.96,78.65 145.71,79.91 145.71,80.61 C2_PWR.3 | BATT_EXT.POS 76.56,106.87 81.72,106.87 97.65,90.94 140.82,90.94 145.57,86.19 C2_PWR.1
C_GND  (via drill 0.51)
  Top 0.305: IC1.4 86.19,36.6 81.72,41.07 68.87,41.07 R20.1 68.73,41.21 v68.73,59.51 | v55.88,75.16 55.88,105.61 53.65,107.85 53.09,107.85 C1_TLM.12
  Bottom 0.305: v55.88,75.16 55.88,72.36 v68.73,59.51
C_ID1  (via drill 0.51)
  Top 0.305: v53.37,101.28 51.69,102.96 51.69,105.33 C1_TLM.4 | v88.8,55.2 90.39,53.52 90.39,49.31 ARD_8.4
  Bottom 0.305: v53.37,101.28 53.37,82.14 79.77,55.74 88.27,55.69 v88.8,55.2
C_ID2  (via drill 0.51)
  Top 0.305: v44.84,97.51 44.84,107.85 C1_TLM.9 | v90.39,47.92 90.39,44.15 96.39,38.14 ARD_8.6
  Bottom 0.305: v44.84,97.51 44.84,87.73 80.47,52.11 89.55,52.11 90.39,51.27 v90.39,47.92
C_ID3
  Bottom 0.305: C1_TLM.10 47.64,107.85 48.2,107.85 50.43,105.61 50.43,82.98 80.33,53.09 98.77,53.09 100.44,51.41 100.44,39.4 99.19,38.14 ARD_9.6
C_ID4  (via drill 0.51)
  Top 0.305: v73.06,64.68 72.64,64.68 67.75,59.79 67.75,50.57 66.92,49.73 66.92,41.21 R20.2
  Bottom 0.305: v73.06,64.68 73.06,93.18 61.19,105.05 61.19,105.75 60.35,106.59 58.12,106.59 57,107.71 57,108.41 56.3,109.11 51.55,109.11 50.43,107.99 C1_TLM.11
C_SCL  (via drill 0.51)
  Top 0.305: v74.74,62.87 69.71,57.84 69.71,50.29 70.55,49.45 77.53,49.45 82.7,44.28 83.68,44.28 IC1.6
  Bottom 0.305: v74.74,62.87 74.74,94.44 63.98,105.19 63.98,107.01 61.75,109.25 59.79,109.25 58.53,107.99 C1_TLM.14
C_SDA  (via drill 0.51)
  Route15 0.305: v79.91,54.76 79.91,50.29 78.93,49.31 78.93,49.17 81.86,46.24 83.26,46.24 85.22,44.28 86.19,44.28 IC1.5
  Bottom 0.305: v79.91,54.76 52.39,82.28 52.39,101.56 55.74,104.92 55.74,107.85 C1_TLM.13
C_TRIG  (via drill 0.51)
  Top 0.305: v88.57,58.12 95.14,51.55 95.14,47.08 96.39,45.82 ARD_8.3
  Bottom 0.305: v88.57,58.12 78.23,58.12 59.93,76.42 59.93,105.33 C1_TLM.7
CAMERA_PWR  (via drill 0.51)
  Top 0.406: v121.54,25.98 122.24,25.98 130.62,17.6 130.62,16.62 141.24,6.01 142.49,6.01 143.89,7.4 143.89,23.61 146.96,26.68 146.96,27.94 146.82,28.08 146.82,29.2 148.08,30.45 148.08,31.29 C3_CMD.14 148.36,31.43 151.85,34.92 151.85,82.98 138.72,96.11 73.06,96.11 63.84,105.33 62.73,105.33 C1_TLM.8
  Bottom 0.406: v121.54,25.98 120.84,26.68 120.84,27.38 PO7.1
CAMERA_PWR_CONTROL
  Top 0.305: ARD_9.4 103.38,47.5 103.38,66.08 94.16,75.3 92.06,75.3 R17.2
CAMERA_PWR_RTN
  Bottom 0.406: C3_CMD.15 148.08,28.64 148.08,29.34 146.13,31.29 145.15,31.29 142.22,34.23 142.22,36.32 132.44,46.1 106.73,46.1 94.58,58.26 94.3,58.26 86.75,65.8 86.75,73.9 83.54,77.11 Q7.C
CUTDOWN_1_FIRE
  Top 0.305: R1.2 75.02,66.08 73.2,66.08 58.53,51.41 58.53,50.85 ARD_6.5
CUTDOWN_2_FIRE
  Top 0.305: R4.2 91.08,64.26 88.85,64.26 85.92,67.2 72.22,67.2 55.88,50.85 ARD_6.4
FLT_CMP_TEMP
  Top 0.305: R26.1 92.06,18.86 92.06,16.07 R27.2 91.92,15.93 86.61,10.62 86.33,10.62 FLT_CMP_TEMP.1
  Bottom 0.305: 77.11,10.48 86.19,10.48 FLT_CMP_TEMP.1
  Bottom 0.406: ARD_2.7 64.65,6.47 64.65,9.2 65.93,10.48 77.11,10.48
GND  (via drill 0.51 pad 0.91)
  Route2 0.406: v44.2,15.4 44.2,8.2 45.9,6.5 45.72,6.32 45.72,5.55 | ARD_1.7 45.72,5.55 | 45.72,5.55 47.22,7.05 49.15,7.05 | 49.15,7.05 v55.6,7.05 57.2,5.45 57.2,4.9 70.05,4.9 71.45,6.3 71.9,6.3 71.5,6.7 v71.5,8.75 | v51.75,9.65 49.15,7.05
  other vias: 88.4,8.65 106.7,79.75 81.95,19.35 75.45,6.7 86.05,17.55 99,62 90.55,71.7
  pour Top: 0.5,117.6 0.5,0.3 158.3,0.3 158.3,117.6
  pour Bottom: 0.5,0.3 157.3,0.3 157.3,117 0.5,117
GYRO_PWR  (via drill 0.51)
  Top 0.305: v127.84,22.51 129.89,22.51 141.25,10.06 141.8,10.06 U$4.GYRO_VCC
  Route2 0.305: 100.7,39.41 99.47,39.4 97.65,39.4 96.53,40.51 ARD_8.5
  Route2 0.406: 100.7,39.41 104.55,35.56 104.55,33.4 110.25,27.7 110.25,21.8 112.15,19.9 125.23,19.9 v127.84,22.51
HEATER_1_PWR  (via drill 0.51 pad 0.91)
  Route2 0.406: v127.3,28.9 128.75,30.35 138.3,30.35 141.45,27.2 141.5,27.2 C3_CMD.8
  Route15 0.406: X1.9 116.79,38.84 126.63,29 v127.3,28.9
  Bottom 0.406: PO4.1 127.32,29.22 127.3,29.2 v127.3,28.9
HEATER_1_PWR_RTN  (via drill 0.51)
  Top 0.406: v150.04,58.26 150.04,46.94 148.22,45.12 C3_CMD.9
  Route2 0.406: X1.10 114.28,38.98 114.97,38.98 120.14,44.15 144.31,44.15 145.15,44.98 148.08,44.98 C3_CMD.9
  Bottom 0.406: v150.04,58.26 150.04,79.21 148.64,80.61 147.66,80.61 146.27,82 145.15,82 140.12,87.03 129.08,87.03 Q4.C
HEATER_2_PWR  (via drill 0.51)
  Top 0.406: v127.41,25.98 129.56,28.34 129.5,38.84 X1.4 129.36,38.98 131.32,40.93 132.02,40.93 136.35,45.26 v137.32,45.26
  Bottom 0.406: v127.41,25.98 127.41,27.38 PO5.1 | v137.32,45.26 140.26,42.33 148.08,42.33 C3_CMD.10
HEATER_2_PWR_RTN  (via drill 0.51)
  Top 0.406: v134.81,45.12 132.99,45.12 128.1,40.23 128.1,40.09 126.99,38.98 X1.5
  Route15 0.406: v134.81,45.12 138.3,48.62 138.3,49.59 138.02,49.87 138.02,65.8 128.94,74.88 128.94,75.58 Q5.C
  Bottom 0.406: v134.81,45.12 143.05,36.88 146.27,36.88 148.08,38.7 148.08,39.53 C3_CMD.11
HEATER_CONTROL_1
  Top 0.305: R10.2 136.21,84.94 137.32,86.06 137.32,87.45 129.36,95.42 81.44,95.42 44.42,58.4 44.42,50.99 44.28,50.85 ARD_7.10
HEATER_CONTROL_2
  Top 0.305: R11.2 135.93,73.06 134.95,73.06 133.97,74.04 130.48,74.04 130.2,74.32 125.17,74.32 115.11,84.38 115.11,91.78 112.04,94.86 81.72,94.86 53.37,66.5 53.37,50.85 ARD_6.3
LOAD_IN
  Bottom 0.406: X2.9 116.51,49.17 115.39,50.29 115.39,50.43 114.55,51.27 108.69,51.27 107.01,49.59 LCC.6
LOAD_OUT  (via drill 0.51)
  Top 0.406: v118.19,24.73 112.88,30.04 112.88,45.54 107.01,51.41 107.01,51.97 LCC.5
  Bottom 0.406: v118.19,24.73 119.16,24.73 121.26,22.63 122.94,22.63 U$3.P1
MISO
  Bottom 0.305: ARD_7.6 35.34,52.11 66.64,52.11 67.33,51.41 67.33,50.15 66.22,49.03 66.22,30.59 ARD_4.1
MOSI
  Bottom 0.305: ARD_4.4 67.89,27.94 66.64,29.2 54.34,29.2 36.6,46.94 36.6,50.71 ARD_7.7
N$15
  Top 0.305: 92.9,60.63 95.28,60.63 95.97,61.33 T2.2 | 92.9,60.63 91.22,60.63 R6.2 | 92.9,60.63 92.9,65.24 92.06,66.08 91.22,66.08 R4.1
N$16
  Top 0.305: 75.16,61.33 75.16,62.03 75.72,62.59 75.72,63.56 75.16,64.12 R1.1 | 75.16,61.33 75.16,60.63 R2.2 | 75.16,61.33 80.89,61.33 T1.2
N$18
  Top 0.305: R10.1 136.07,86.89 133.27,86.89 R12.2 133.13,86.89 131.74,86.89 129.08,89.55 Q4.B
N$19
  Top 0.305: R6.1 91.22,58.53 93.88,58.53 94.72,59.37 T2.3 94.86,59.37 95.97,58.26 97.65,58.26 97.79,58.4 100.86,58.4 R8.2
  Bottom 0.305: Q2.B 95.69,65.1 95.69,62.59 94.86,61.75 94.86,59.51 T2.3
N$22
  Top 0.305: R11.1 135.93,75.02 133.13,75.02 R13.2 132.85,75.02 132.16,75.02 128.94,78.23 Q5.B
N$23
  Top 0.305: R2.1 75.16,58.53 78.79,58.53 79.63,59.37 T1.3 79.77,59.37 80.89,58.26 82.56,58.26 82.7,58.4 85.36,58.4 R3.2
  Bottom 0.305: Q1.B 80.33,65.1 80.33,62.45 79.77,61.89 79.77,59.51 T1.3
N$24
  Top 0.305: R16.1 91.92,87.03 91.08,87.03 89.13,88.99 R18.2 88.85,88.99 85.64,92.2 83.54,92.2 Q6.B
N$26
  Top 0.305: R5.1 111.34,93.6 111.34,91.22 R7.2 111.48,91.08 111.48,89.69 112.6,88.57 T3.2
N$27
  Top 0.305: 110.22,86.47 111.34,86.47 T3.3 | 110.22,86.47 109.39,86.47 | 109.39,86.47 108.13,86.47 R9.2 | 109.39,86.47 109.39,91.08 R7.1 | 110.22,86.47 110.22,76.56 Q3.B
N$31
  Top 0.305: R17.1 91.92,77.53 89.13,77.53 R19.2 88.85,77.39 85.64,77.39 83.54,79.49 Q7.B
PYRO_1_PWR  (via drill 0.51)
  Top 0.406: v140.54,34.23 140.54,34.65 141.66,35.76 v141.66,45.12
  Bottom 0.406: v140.54,34.23 140.54,35.34 139.42,36.46 137.6,36.46 134.25,33.11 133.97,33.11 PO1.1 | v141.66,45.12 144.31,45.12 145.57,46.38 C3_CMD.1
PYRO_1_PWR_RTN
  Top 0.406: T1.1 82.28,59.51 82.28,64.54 82.84,65.1 Q1.C
  Route15 0.406: C3_CMD.2 145.57,43.59 144.45,43.59 144.03,43.17 109.98,43.17 105,48.15 105,52.95 100.3,57.65 94.8,57.65 94.4,58.05 94.22,58.05 92.9,59.37 82.28,59.37 T1.1
PYRO_2_PWR  (via drill 0.51 pad 0.91)
  Route2 0.406: v133.95,28.9 137.45,25.35 149.6,25.35 152.1,27.85 152.1,28.15 151.3,28.95 151.3,39.45 149.75,41 149.6,41 149.51,40.91 C3_CMD.3
  Bottom 0.406: PO2.1 133.93,29.02 133.95,29 v133.95,28.9
PYRO_2_PWR_RTN
  Top 0.406: T2.1 97.37,59.51 97.37,64.26 98.21,65.1 Q2.C
  Bottom 0.406: C3_CMD.4 145.57,38.28 142.91,38.28 135.79,45.4 135.79,45.54 134.39,46.94 107.43,46.94 97.37,57 97.37,59.37 T2.1
RESET  (via drill 0.51)
  Top 0.305: v115.25,15.93 105.47,6.15 92.62,6.15 v91.08,7.68 | v47.92,14.95 51.69,14.95 62.03,25.29 66.08,25.29 ARD_4.5
  Bottom 0.305: v115.25,15.93 123.77,15.93 125.59,17.74 131.74,17.74 U$2.P1_RESET | v91.08,7.68 76,22.77 68.73,22.77 66.22,25.29 ARD_4.5 | v47.92,14.95 35.62,2.65 ARD_1.3
RX0
  Top 0.305: X3.2 5.59,36.18 47.64,36.18 60.91,49.45 64.68,49.45 65.94,50.71 ARD_6.8
RX1
  Route15 0.305: ARD_5.6 86.45,53.43 86.45,53.45 100.2,53.45 101.65,52 101.65,23.8 103.55,21.9 103.55,19.55 105,18.1 GPS.5
RX3
  Bottom 0.305: ARD_5.2 73.62,50.71 72.92,50.71 71.67,49.45 70.13,49.45 66.08,53.51 38.56,53.51 37.3,54.76 RB1.2
S/A_PWR_IN
  Top 0.406: C2_PWR.8 145.57,66.92 145.57,67.89 144.31,69.15 144.31,71.11 145.57,72.36 C2_PWR.6 145.71,72.5 145.71,73.2 146.96,74.46 146.96,75.72 146.82,75.86 146.82,76.97 146.96,77.11 146.96,78.37 146.82,78.51 146.82,79.77 148.08,81.03 148.08,81.86 C2_PWR.10
  Bottom 0.406: SACC.6 125.59,75.86 125.59,73.76 127.55,71.81 145.01,71.81 145.57,72.36 C2_PWR.6 | U$3.P2 123.08,17.88 124.75,17.88 125.87,19 140.54,19 150.46,28.92 150.46,45.82 145.99,50.29 145.71,50.29 143.75,52.25 143.75,61.19 145.57,63.01 145.57,66.78 C2_PWR.8
S/A_PWR_OUT  (via drill 0.51)
  Top 0.406: v113.86,41.63 128.38,41.63 133.69,46.94 134.81,46.94 136.91,49.03 X2.1
  Bottom 0.406: X2.1 136.91,49.17 136.91,52.25 124.05,65.1 124.05,77.11 SACC.5 | v113.86,41.63 110.62,38.4 110.57,21.99 112.88,19.84 112.88,17.88 U$3.P2A
S/A_PWR_RTN
  Top 0.406: C2_PWR.7 145.71,69.71 145.71,70.41 147.66,72.36 148.64,72.36 149.48,73.2 149.48,77.95 148.22,79.21 C2_PWR.11 148.36,79.35 149.48,80.47 149.48,82.56 148.22,83.82 148.22,84.66 C2_PWR.9
  Route2 0.406: X2.2 134.39,51.79 142.95,60.35 142.95,66.95 C2_PWR.7
SCK
  Bottom 0.305: ARD_4.3 54.34,27.94 31.57,50.71 ARD_7.5
SCL
  Top 0.305: 108.41,57 107.01,57 LCC.3 | 108.41,57 135.93,57 140.96,51.97 140.96,51.13 140.68,50.85 140.68,35.76 139.56,34.65 139.56,30.32 141.8,28.08 141.8,15.09 U$4.GYRO_SCL | 108.41,57 108.41,63.01 101.14,70.27 101.14,81.86 102.54,83.26 102.54,83.82 B2CC.3
  Route2 0.305: ARD_5.8 88.99,50.85 89.55,50.85 95.69,57 106.87,57 LCC.3
  Bottom 0.305: SACC.3 125.45,83.68 125.31,83.82 102.68,83.82 B2CC.3 102.4,83.82 79.21,83.82 B1CC.3
SCL1
  Top 0.305: C1_TLM.6 57.14,105.33 57.14,71.94 43.87,58.67 43.87,55.74 40.37,52.25 22.77,52.25 21.37,50.85 ARD_7.1
SDA
  Top 0.305: ARD_5.7 86.47,50.85 86.47,57.7 92.34,63.56 92.34,64.96 92.06,65.24 90.25,65.24 80.47,75.02 80.47,80.05 79.21,81.31 B1CC.4 | U$4.GYRO_SDA 141.8,12.57 141.84,12.73 138.02,16.9 138.02,37.44 138.3,37.72 138.3,50.29 134.11,54.48 107.01,54.48 LCC.4
  Bottom 0.305: 101.14,79.91 101.14,75.72 102.12,74.74 102.12,60.07 106.87,55.32 106.87,54.62 LCC.4 | 101.14,79.91 B2CC.4 102.54,81.17 125.45,81.17 SACC.4 | B1CC.4 79.21,81.31 99.61,81.31 101,79.91 101.14,79.91
SDA1  (via drill 0.51)
  Top 0.305: v50.57,80.33 54.34,84.1 54.34,105.33 C1_TLM.5
  Bottom 0.305: v50.57,80.33 25.15,54.9 25.15,52.11 23.89,50.85 ARD_7.2
SPARE_1_PWR  (via drill 0.51)
  Route2 0.406: v120.14,33.25 120.14,33.39 120,33.53 120,36.74 120.56,37.3 144.73,37.3 145.15,36.88 148.08,36.88 C3_CMD.12
  Bottom 0.406: v120.14,33.25 120.7,32.69 120.7,30.32 PO6.1 | SPRL1.1 131.32,63.14 139,55.46 139,51.13 142.35,47.78 147.38,47.78 149.62,45.54 149.62,38.28 148.22,36.88 C3_CMD.12
SPARE_1_PWR_RTN
  Top 0.406: C3_CMD.13 148.22,34.09 148.22,34.92 151.02,37.72 151.02,60.07 145.57,65.52 140.82,65.52 134.53,71.81 112.32,71.81 104.08,80.05 104.08,89.41 99.89,93.6 82.28,93.6 81.44,92.76 81.44,91.78 83.4,89.83 Q6.C
SPARE_HIGH_1_CONTROL
  Top 0.305: R5.2 109.25,93.74 100.72,93.74 100.17,94.3 82,94.3 80.75,93.04 80.75,80.61 81.44,79.91 81.44,76.56 82.28,75.72 86.75,75.72 86.75,75.7 87.45,75 87.45,69.2 88.75,67.9 91.65,67.9 92.35,67.2 98.91,67.2 99.61,66.5 99.61,63.84 102.26,61.19 102.26,51.41 99.19,48.34 ARD_9.2
SPARE_HIGH_1_PWR  (via drill 0.51)
  Top 0.406: v140.54,30.73 140.96,30.73 145.57,35.34 C3_CMD.5 145.43,35.48 142.63,38.28 142.63,60.07 140.68,62.03 140.54,62.03 139.42,63.14 SPRH1.1
  Bottom 0.406: v140.54,30.73 140.54,28.5 137.05,25.01 135.37,25.01 133.97,26.4 133.97,27.38 PO3.1
SPARE_HIGH_1_PWR_RTN  (via drill 0.51)
  Top 0.406: T3.1 113.86,86.47 113.86,77.53 112.88,76.56 Q3.C | v123.08,66.08 139.14,66.08 143.47,61.75 143.47,38.56 145.15,36.88 146.13,36.88 146.96,36.04 146.96,34.78 145.71,33.53 145.71,32.69 C3_CMD.6
  Bottom 0.406: v123.08,66.08 112.74,76.42 Q3.C
SPARE_LOW_1_CONTROL
  Top 0.305: R16.2 92.06,88.99 93.18,87.87 93.18,76.69 92.9,76.42 91.08,76.42 90.81,76.14 90.81,74.74 97.79,67.75 100.86,67.75 102.82,65.8 102.82,49.45 99.19,45.82 ARD_9.3
TEMP_EXT_1  (via drill 0.51)
  Top 0.305: R23.2 68.03,16.07 68.03,19 R22.1 | R22.1 68.17,19 70.13,19 71.11,19.98 72.92,19.98 73.2,19.7 73.2,4.61 71.25,2.65 ARD_2.8 | v42.94,60.82 43.31,62.19 43.31,105.33 C1_TLM.1 | v65.94,19.49 67.3,19.49 67.89,19.14 R22.1
  Route2 0.305: v42.94,60.82 42.89,44.49 v65.94,19.49
TEMP_EXT_2
  Top 0.305: R24.1 72.08,19 72.08,16.07 R25.2 71.94,15.93 66.08,10.06 66.08,2.65 ARD_2.6
  Bottom 0.305: C1_TLM.3 48.9,105.33 48.9,102.82 24.59,78.51 24.59,54.34 23.33,53.09 16.9,53.09 15.51,51.69 15.51,49.87 61.47,3.91 64.68,3.91 65.94,2.65 ARD_2.6
TX0  (via drill 0.51)
  Top 0.305: v48.76,36.04 46.94,34.23 5.59,34.23 X3.3
  Bottom 0.305: v48.76,36.04 63.42,50.71 ARD_6.7
TX1
  Route15 0.305: ARD_5.5 84.53,54.05 100.9,54.05 104.05,50.9 104.05,32.1 108.85,27.3 108.85,19.11 GPS.6
TX3
  Bottom 0.305: ARD_5.1 71.11,50.85 69.57,50.85 64.26,56.16 36.04,56.16 34.78,54.9 RB1.3
VIN
  Top 0.406: R14.2 58.95,14.39 58.95,13.27 48.34,2.65 ARD_1.8 | GPS.8 105.33,10.62 105.33,11.04 110.92,16.62 110.92,20.54 112.88,22.49 U$3.P1A
  Bottom 0.406: PVIN5.1 125.03,26.96 PVIN4.1 | PVIN1.1 131.6,32.41 131.6,29.76 PVIN2.1 131.6,29.62 131.6,26.96 PVIN3.1 131.6,26.68 131.6,26.12 130.48,25.01 126.85,25.01 125.17,26.68 PVIN5.1 | PVIN7.1 118.47,26.96 118.47,29.62 PVIN6.1 | PVIN7.1 118.33,26.68 117.07,26.68 113.02,22.63 U$3.P1A | PVIN5.1 125.31,26.26 124.05,25.01 120,25.01 118.47,26.54 PVIN7.1 | ARD_1.8 48.34,2.52 51.27,2.52 52.67,1.12 72.78,1.12 77.81,6.15 100.86,6.15 105.19,10.48 GPS.8
VIN_VOLTAGE_TLM
  Top 0.305: R15.2 61.05,17.88 61.05,14.53 R14.1 61.05,14.39 61.05,10.06 C1.1 61.05,9.92 61.05,2.65 ARD_2.4

### Text on the board
tPlace: B. EXT / HOLE | B. EXT / HOLE | RB / HOLE | BATT2 / HOLE | RB / HOLE | ARD / HOLD | ARD / HOLD | ARD / HOLD | ARD / HOLD | GYRO HOLE | ARD / HOLD | ARD / HOLD
tNames: AlphaNewt v2.0 / ASTRONEWTS LLC | EXTERNAL BATTERY | ROCKBLOCK | Battery 2 / Current Sense | Solar Array / Current Sense | Battery 1 / Current Sense | USB-A | LOAD / Current Sense | SD BOARD | GPS BOARD | GYRO BOARD | ALTIMETER | Flight Temp Sensor
bNames: VIN | B_EXT | P1 | VIN | B_EXT | VIN | B_EXT | P6 | P4 | P2 | P7 | P5 | P3 | ARDUINO
tDocu: STRUCT Mount | GYRO + MPPT Hole